# Altium schematic sheet UM7_Schematic.SchDoc
size A
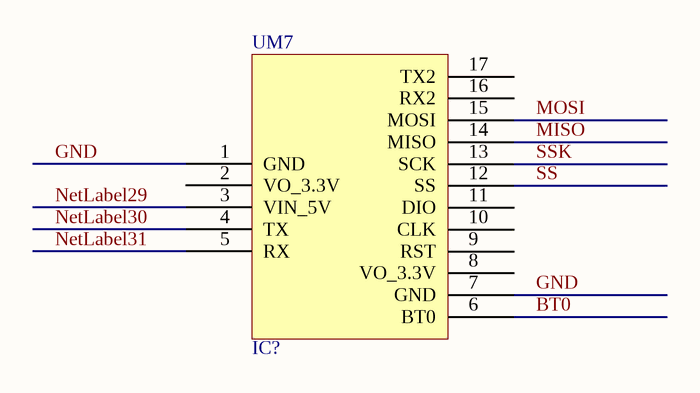
[diagram p0: UM7_Schematic.SchDoc]

## Parts
UM7  IC?

## Nets
BT0: UM7.6(BT0)
GND: UM7.1(GND) UM7.7(GND)
MISO: UM7.14(MISO)
MOSI: UM7.15(MOSI)
NetLabel29: UM7.3(VIN_5V)
NetLabel30: UM7.4(TX)
NetLabel31: UM7.5(RX)
SS: UM7.12(SS)
SSK: UM7.13(SCK)

Not connected (* = marked no-connect by the designer): UM7 2(VO_3.3V) 8(VO_3.3V) 9(RST) 10(CLK) 11(DIO) 16(RX2) 17(TX2)